# EAGLE design SOIC+TSSOP-16 300mil DIP (EAGLE 6.6.0)
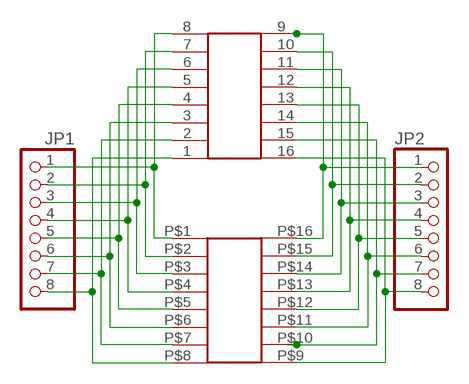
[diagram p0: schematic, sheet 1]

## Parts
JP1  PINHD-1X8  [1X08]
JP2  PINHD-1X8  [1X08]
U$1  SMD-16SOIC  [SO-16NMW]
U$2  SMD-16TSSOP  [TSSOP-16NM]

## Nets
N$1: JP1.1 U$1.P$1 U$2.8
N$2: JP1.2 U$1.P$2 U$2.7
N$3: JP1.3 U$1.P$3 U$2.6
N$4: JP1.4 U$1.P$4 U$2.5
N$5: JP1.5 U$1.P$5 U$2.4
N$6: JP1.6 U$1.P$6 U$2.3
N$7: JP1.7 U$1.P$7 U$2.2
N$8: JP1.8 U$1.P$8 U$2.1
N$9: JP2.1 U$1.P$16 U$2.9
N$10: JP2.2 U$1.P$15 U$2.10
N$11: JP2.3 U$1.P$14 U$2.11
N$12: JP2.4 U$1.P$13 U$2.12
N$13: JP2.5 U$1.P$12 U$2.13
N$14: JP2.6 U$1.P$11 U$2.14
N$15: JP2.7 U$1.P$10 U$2.15
N$16: JP2.8 U$1.P$9 U$2.16

## Library data of the parts
JP1 JP2 = pinhead:PINHD-1X8: PIN HEADER
U$1 U$2 = boogie:SMD-16

## Board
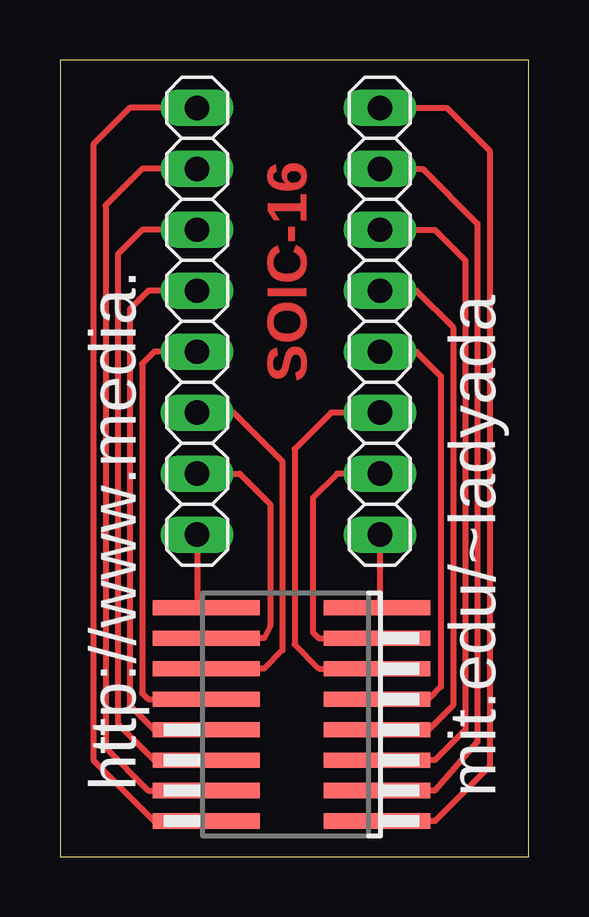
[diagram p1: board, top side]
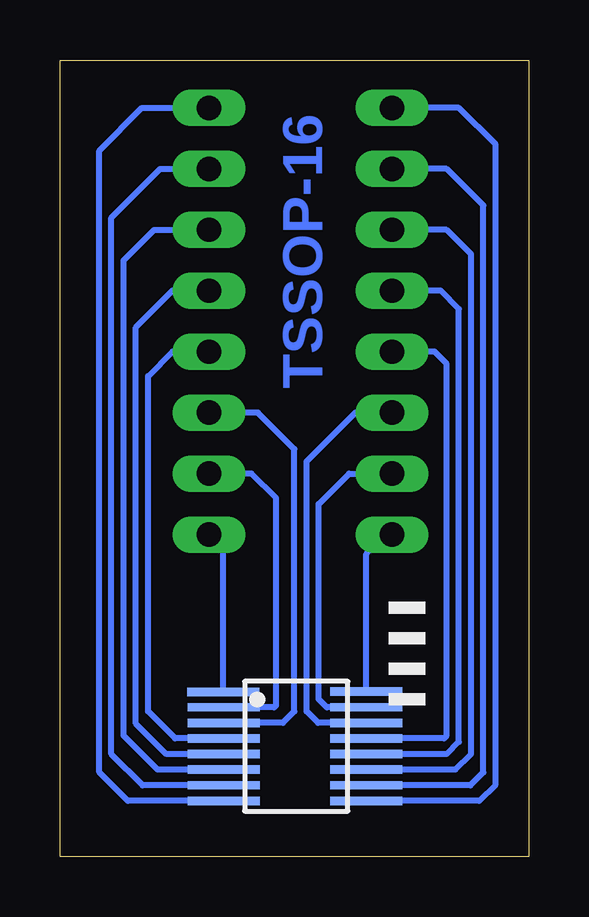
[diagram p2: board, bottom side, seen from below]

Size 19.54 x 33.2 mm. Coordinates in mm from the lower left corner, seen from the top.
Outline: 0,0 19.54,0 19.54,33.2 0,33.2 0,0
Copper layers (1*16): Top 0.035mm / dielectric 1.5mm / Bottom 0.035mm
Design rules "default": minimum track width 10mil, minimum drill 24mil, track to track 10mil, track to pad 8mil, pad to pad 8mil, via to via 8mil, smd to smd 8mil, copper to edge 40mil, drill to drill 8mil, minimum pad ring 10mil, minimum via ring 8mil, stop-mask expansion 4mil, vias tented up to drill 0mil, thermal gap 10mil

### Footprints (pad centres in the part's own frame; a part is rotated, then mirrored left to right if it is on the bottom)
1X08 = drill 1.016 long: 1 -8.89,0; 2 -6.35,0; 3 -3.81,0; 4 -1.27,0; 5 1.27,0; 6 3.81,0; 7 6.35,0; 8 8.89,0
SO-16NMW = smd 0.635 x 4.445: P$1 -3.048,-3.683; P$2 -1.778,-3.683; P$3 -0.508,-3.683; P$4 0.762,-3.683; P$5 2.032,-3.683; P$6 3.302,-3.683; P$7 4.572,-3.683; P$8 5.842,-3.683; P$9 5.842,3.429; P$10 4.572,3.429; P$11 3.302,3.429; P$12 2.032,3.429; P$13 0.762,3.429; P$14 -0.508,3.429; P$15 -1.778,3.429; P$16 -3.048,3.429
TSSOP-16NM = smd 0.35 x 3: 1 0.205,-4.493; 2 0.845,-4.469; 3 1.495,-4.469; 4 2.145,-4.469; 5 2.795,-4.469; 6 3.445,-4.469; 7 4.095,-4.469; 8 4.745,-4.469; 9 4.745,1.481; 10 4.095,1.481; 11 3.445,1.481; 12 2.795,1.481; 13 2.145,1.481; 14 1.495,1.481; 15 0.845,1.481; 16 0.195,1.481

### Placement (x,y rotation side)
JP1  13.33,22.31 270 top
JP2  5.71,22.31 270 top
U$1  9.52,4.53 90 top
U$2  8.25,7.07 270 bottom

### Tracks (layer width: path | path; a pad name or v marks a point on that pad's centre or on a via)
N$1
  Top 0.254: U$1.P$1 15.62,1.49 17.9,3.77 17.9,29.43 16.12,31.2 JP1.1
  Bottom 0.254: U$2.8 16.71,2.33 17.9,3.52 17.9,29.43 16.12,31.2 13.58,31.2 13.33,30.95 JP1.1
N$2
  Top 0.254: U$1.P$2 15.62,2.76 17.39,4.79 17.39,26.38 15.11,28.66 JP1.2
  Bottom 0.254: U$2.7 16.09,2.98 17.39,4.28 17.39,26.63 15.36,28.66 JP1.2
N$3
  Top 0.254: U$1.P$3 15.62,4.03 16.89,5.3 16.89,24.85 15.62,26.12 JP1.3
  Bottom 0.254: U$2.6 15.47,3.63 16.89,5.04 16.89,24.85 15.62,26.12 JP1.3
N$4
  Top 0.254: U$1.P$4 15.36,5.3 16.38,6.31 16.38,22.06 14.85,23.58 JP1.4
  Bottom 0.254: U$2.5 15.11,4.28 16.38,5.55 16.38,22.06 14.85,23.58 JP1.4
N$5
  Top 0.254: U$1.P$5 15.36,6.57 15.87,7.07 15.87,20.03 14.85,21.04 JP1.5 13.08,21.04
  Bottom 0.254: U$2.4 14.74,4.93 15.87,6.06 15.87,20.03 14.85,21.04 JP1.5
N$6
  Top 0.254: U$1.P$6 10.79,7.84 9.77,8.85 9.77,16.98 11.3,18.5 JP1.6
  Bottom 0.254: U$2.3 10.25,5.58 9.77,6.06 9.77,16.98 11.3,18.5 JP1.6
N$7
  Top 0.254: U$1.P$7 10.79,9.11 10.54,9.36 10.54,14.95 11.55,15.96 JP1.7
  Bottom 0.254: U$2.2 10.62,6.23 10.54,6.31 10.54,14.95 11.55,15.96 JP1.7
N$8
  Top 0.254: U$1.P$8 13.08,10.38 13.33,10.63 JP1.8
  Bottom 0.254: U$2.1 12.74,12.84 JP1.8
N$9
  Top 0.254: U$1.P$16 3.93,1.49 1.39,4.03 1.39,29.68 2.92,31.2 5.46,31.2 5.71,31.46 JP2.1
  Bottom 0.254: U$2.9 2.07,2.33 1.39,3.01 1.39,29.68 2.92,31.2 JP2.1
N$10
  Top 0.254: U$1.P$15 3.68,2.76 1.9,4.53 1.9,27.14 3.42,28.66 JP2.2
  Bottom 0.254: U$2.10 2.44,2.98 1.9,3.52 1.9,27.14 3.42,28.66 JP2.2
N$11
  Top 0.254: U$1.P$14 3.93,4.03 2.41,5.55 2.41,25.11 3.42,26.12 JP2.3
  Bottom 0.254: U$2.11 3.06,3.63 2.41,4.28 2.41,25.11 3.42,26.12 JP2.3
N$12
  Top 0.254: U$1.P$13 3.93,5.3 2.92,6.31 2.92,22.82 3.68,23.58 JP2.4
  Bottom 0.254: U$2.12 3.42,4.28 2.92,4.79 2.92,22.82 3.68,23.58 JP2.4
N$13
  Top 0.254: U$1.P$12 3.68,6.57 3.42,6.82 3.42,20.54 3.93,21.04 JP2.5
  Bottom 0.254: U$2.13 3.54,4.93 3.42,5.04 3.42,20.54 3.93,21.04 JP2.5
N$14
  Top 0.254: U$1.P$11 8.5,7.84 9.27,8.6 9.27,16.47 7.23,18.5 JP2.6
  Bottom 0.254: U$2.14 8.79,5.58 9.27,6.06 9.27,16.47 7.23,18.5 JP2.6
N$15
  Top 0.254: JP2.7 7.49,15.96 8.76,14.69 8.76,9.61 8.5,9.11 U$1.P$10
  Bottom 0.254: U$2.15 8.42,6.23 8.76,6.57 8.76,14.69 7.49,15.96 JP2.7 5.46,15.96
N$16
  Top 0.254: U$1.P$9 5.71,10.38 JP2.8
  Bottom 0.254: JP2.8 5.96,13.42 6.77,12.62 U$2.16

### Text on the board
Top: SOIC-16
Bottom: TSSOP-16
tPlace: http://www.media. | mit.edu/~ladyada